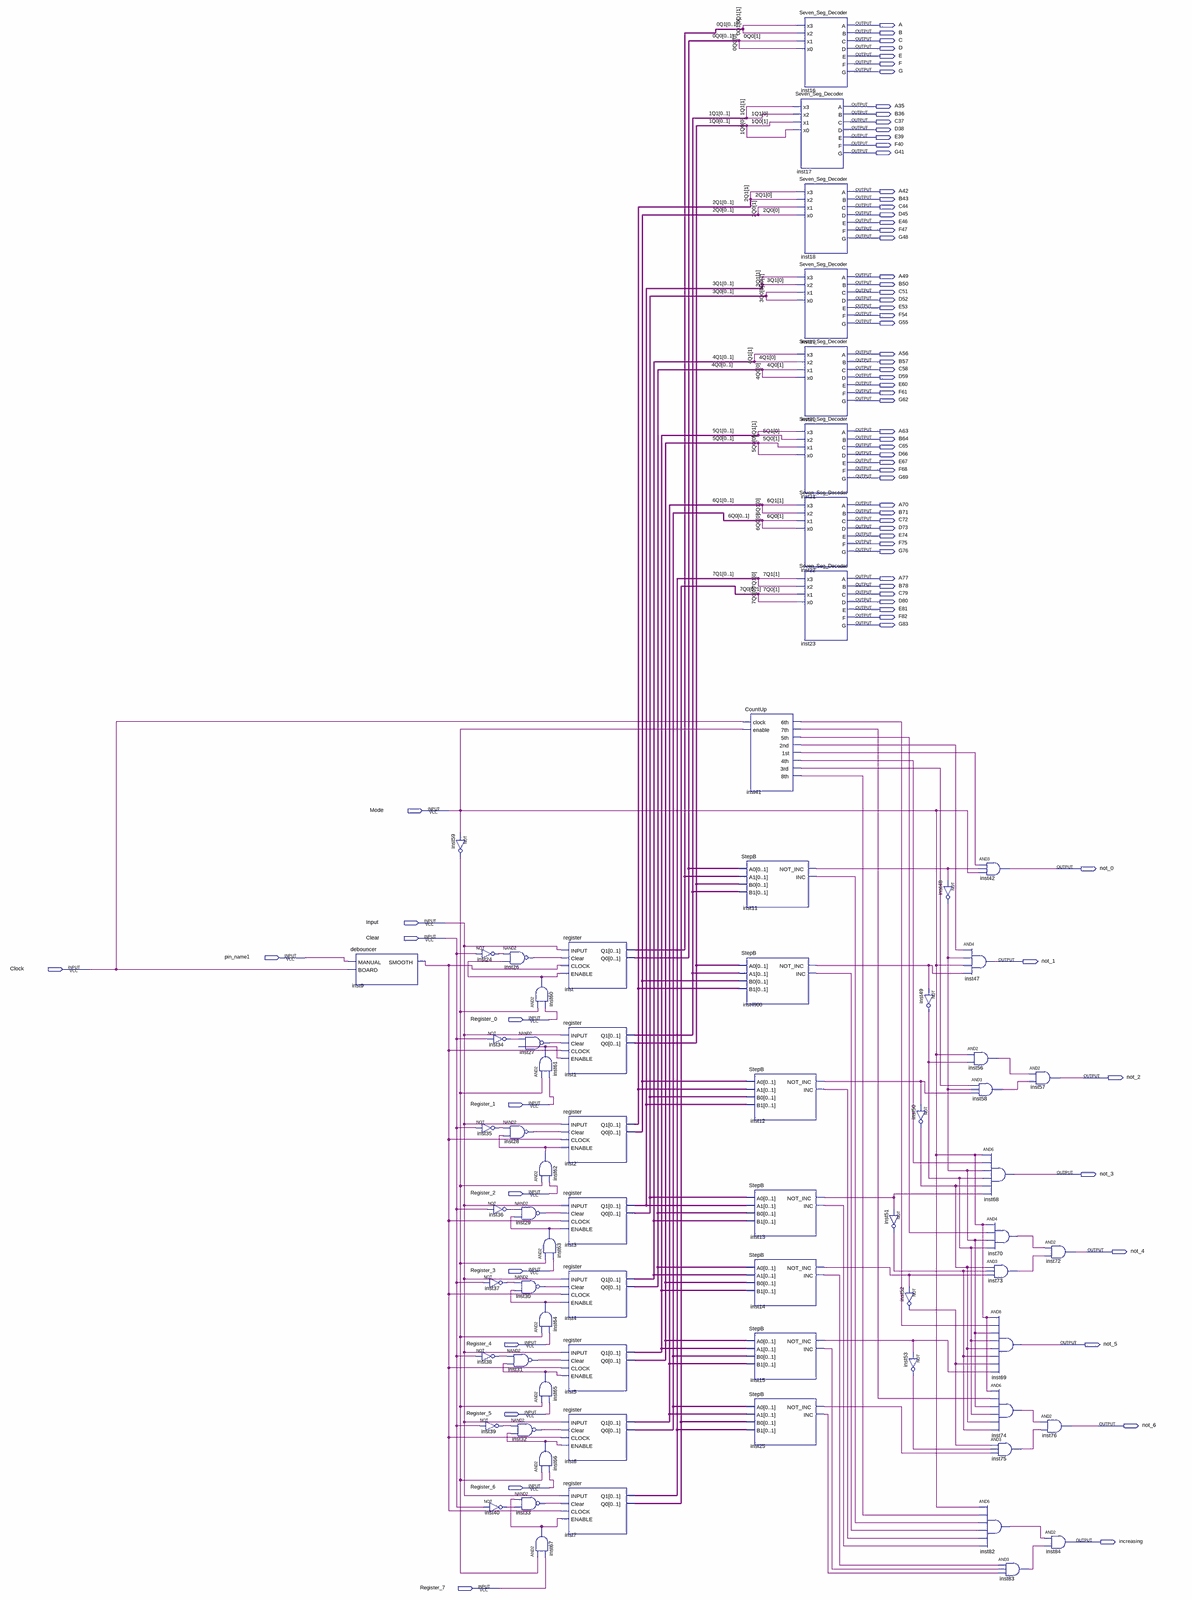
[diagram p0: schematic sheet, whole]
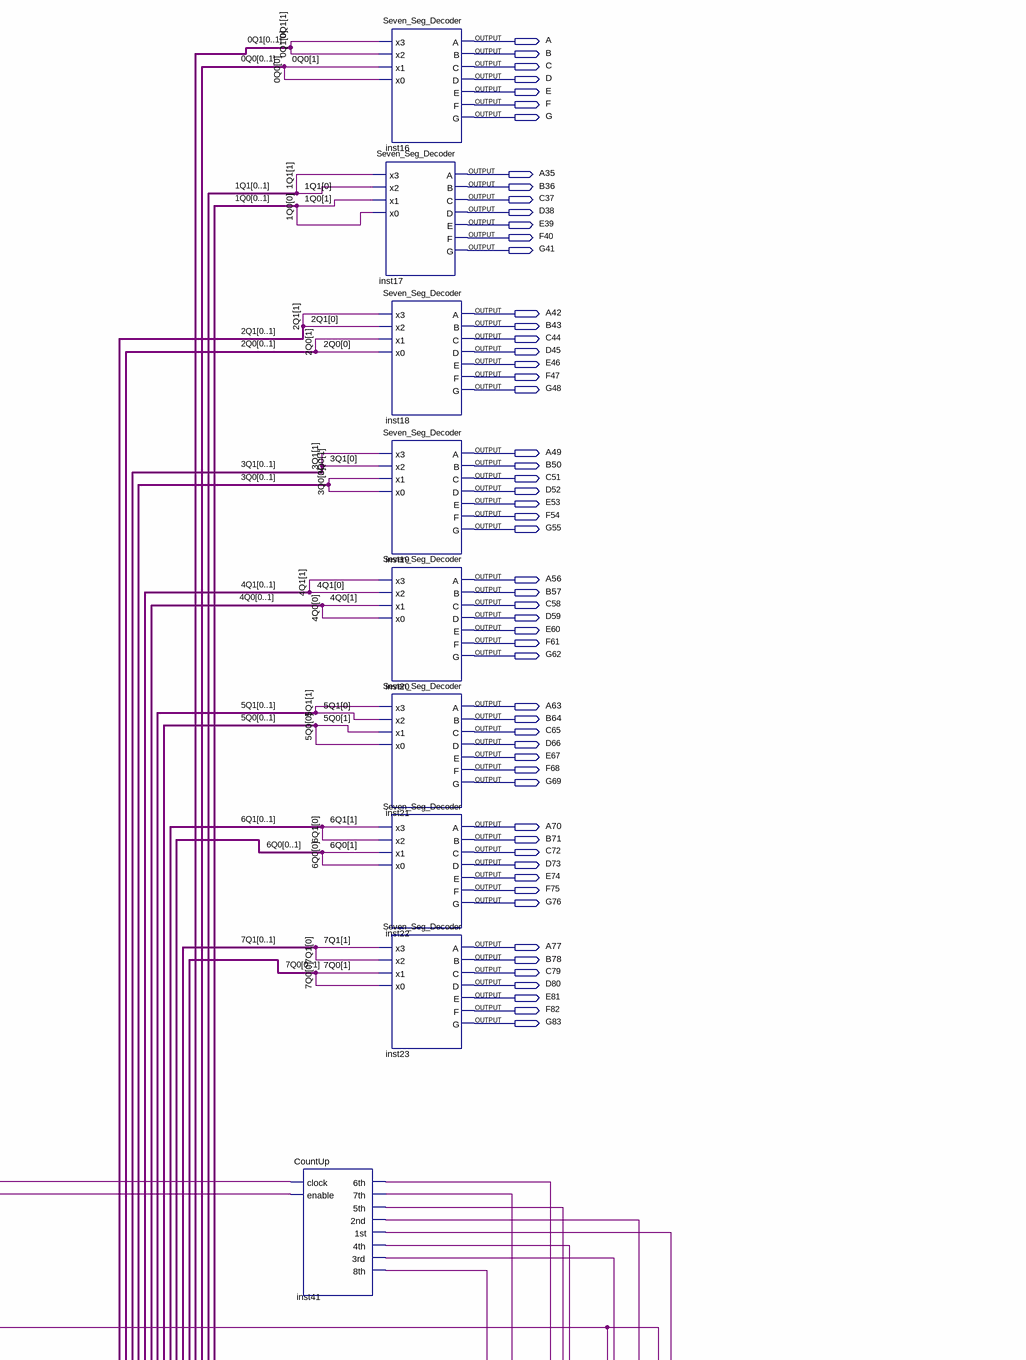
[diagram p1: schematic sheet, upper right part]
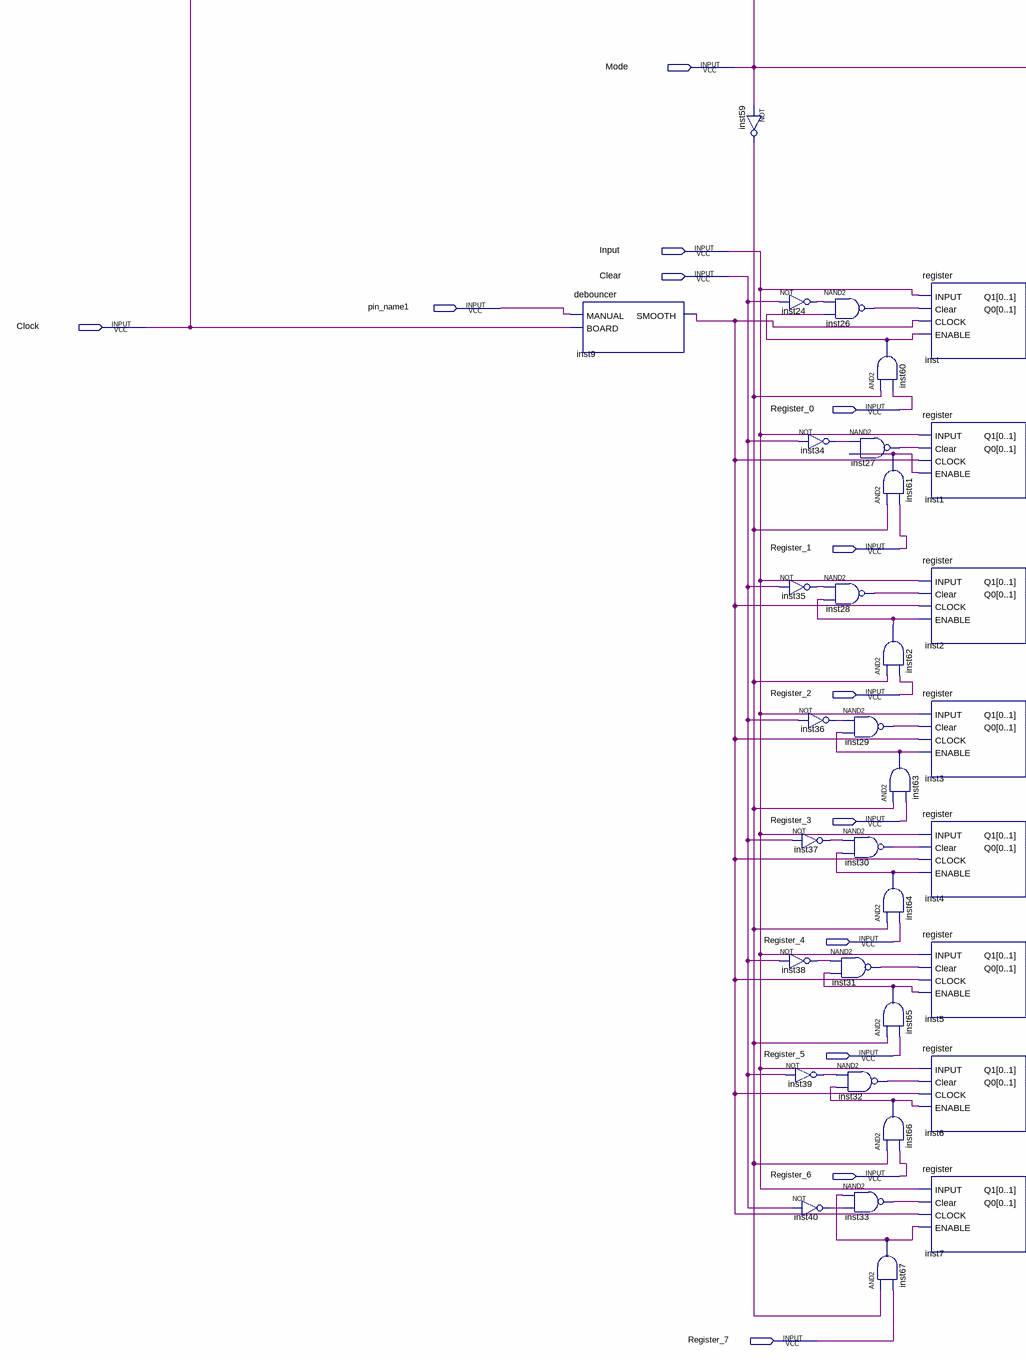
[diagram p2: schematic sheet, lower left part]
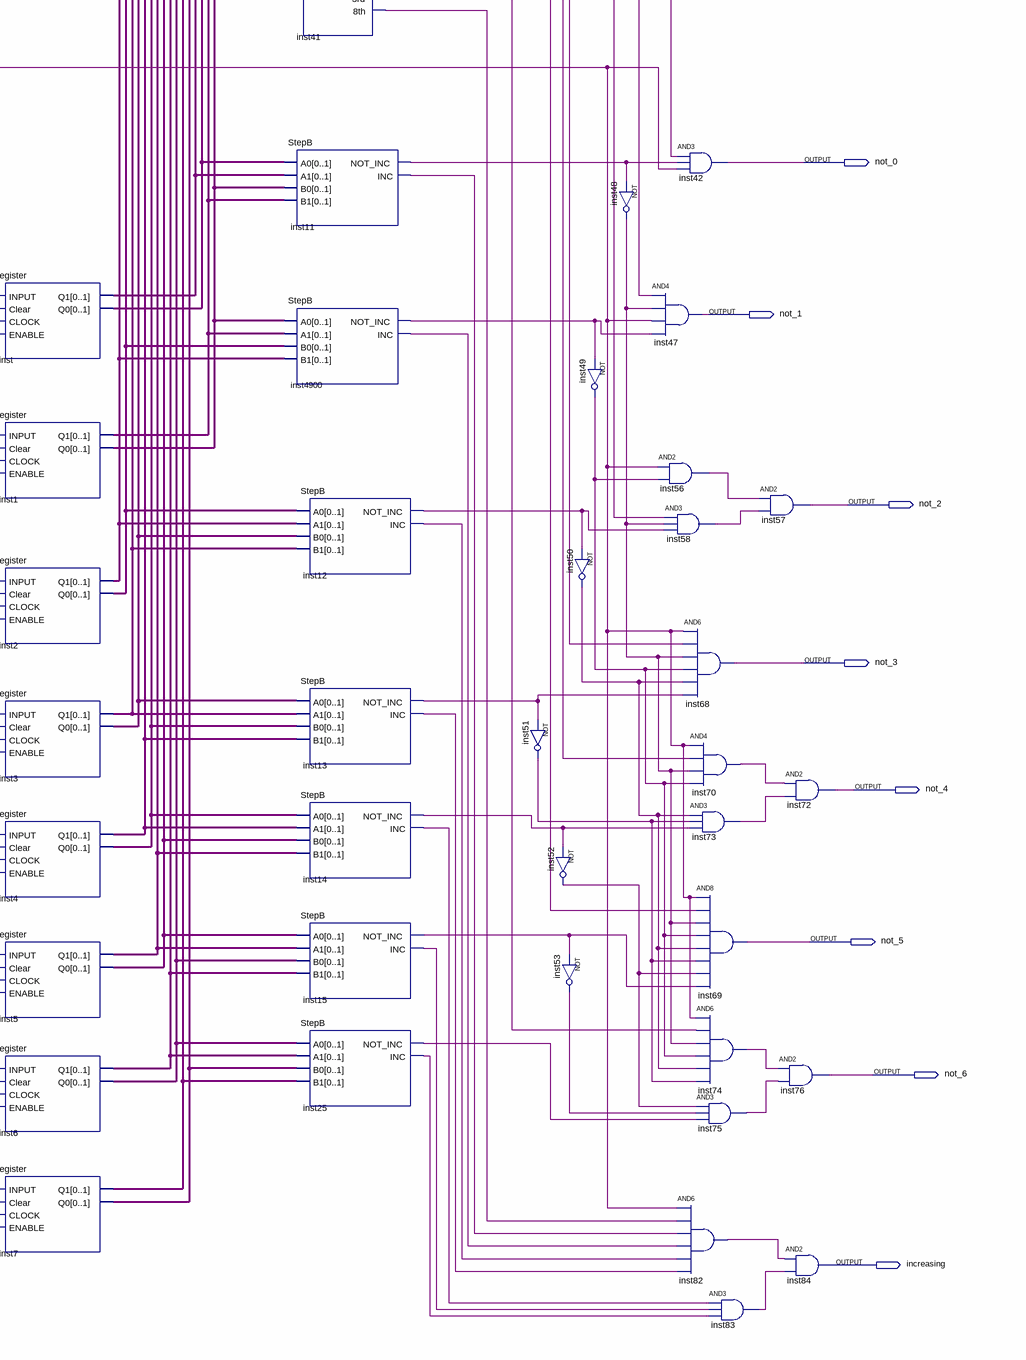
[diagram p3: schematic sheet, lower right part]
// Quartus schematic stepD.bdf as structural Verilog: 72 symbols, 77 pins
module stepD (
  input  Mode,
  input  Input,
  input  Clear,
  input  pin_name1,
  input  Clock,
  input  Register_0,
  input  Register_1,
  input  Register_2,
  input  Register_3,
  input  Register_4,
  input  Register_5,
  input  Register_6,
  input  Register_7,
  output A,
  output B,
  output C,
  output D,
  output E,
  output F,
  output G,
  output A35,
  output B36,
  output C37,
  output D38,
  output E39,
  output F40,
  output G41,
  output A42,
  output B43,
  output C44,
  output D45,
  output E46,
  output F47,
  output G48,
  output A49,
  output B50,
  output C51,
  output D52,
  output E53,
  output F54,
  output G55,
  output A56,
  output B57,
  output C58,
  output D59,
  output E60,
  output F61,
  output G62,
  output A63,
  output B64,
  output C65,
  output D66,
  output E67,
  output F68,
  output G69,
  output A70,
  output B71,
  output C72,
  output D73,
  output E74,
  output F75,
  output G76,
  output A77,
  output B78,
  output C79,
  output D80,
  output E81,
  output F82,
  output G83,
  output not_0,
  output not_1,
  output not_2,
  output not_3,
  output not_4,
  output not_5,
  output not_6,
  output increasing
);

  wire inst9_smooth, inst11_inc, inst11_not_inc, inst12_inc, inst12_not_inc, inst13_inc, inst13_not_inc,
       inst14_inc, inst14_not_inc, inst15_inc, inst15_not_inc, inst24_out, inst25_inc, inst25_not_inc,
       inst26_out, inst27_out, inst28_out, inst29_out, inst30_out, inst31_out, inst32_out, inst33_out,
       inst34_out, inst35_out, inst36_out, inst37_out, inst38_out, inst39_out, inst40_out, inst41_1st,
       inst41_2nd, inst41_3rd, inst41_4th, inst41_5th, inst41_6th, inst41_7th, inst41_8th, inst48_out,
       inst49_out, inst50_out, inst51_out, inst52_out, inst53_out, inst56_out, inst58_out, inst59_out,
       inst60_out, inst61_out, inst62_out, inst63_out, inst64_out, inst65_out, inst66_out, inst67_out,
       inst70_out, inst73_out, inst74_out, inst75_out, inst82_out, inst83_out, inst4900_inc, inst4900_not_inc;
  wire [1:0] \0Q0 , \0Q1 , \1Q0 , \1Q1 , \2Q0 , \2Q1 , \3Q0 , \3Q1 , \4Q0 , \4Q1 , \5Q0 , \5Q1 , \6Q0 ,
       \6Q1 , \7Q0 , \7Q1 ;

  debouncer inst9 (.MANUAL(pin_name1), .BOARD(Clock), .SMOOTH(inst9_smooth));
  not inst59 (inst59_out, Mode);
  not inst24 (inst24_out, Clear);
  not inst34 (inst34_out, Clear);
  not inst35 (inst35_out, Clear);
  not inst36 (inst36_out, Clear);
  not inst37 (inst37_out, Clear);
  not inst38 (inst38_out, Clear);
  not inst39 (inst39_out, Clear);
  not inst40 (inst40_out, Clear);
  nand inst26 (inst26_out, inst24_out, inst60_out);
  nand inst27 (inst27_out, inst34_out, inst61_out);
  nand inst28 (inst28_out, inst35_out, inst62_out);
  nand inst29 (inst29_out, inst36_out, inst63_out);
  nand inst30 (inst30_out, inst37_out, inst64_out);
  nand inst31 (inst31_out, inst38_out, inst65_out);
  nand inst32 (inst32_out, inst39_out, inst66_out);
  nand inst33 (inst33_out, inst67_out, inst40_out);
  and inst60 (inst60_out, inst59_out, Register_0);
  and inst61 (inst61_out, inst59_out, Register_1);
  and inst62 (inst62_out, inst59_out, Register_2);
  and inst63 (inst63_out, inst59_out, Register_3);
  and inst64 (inst64_out, inst59_out, Register_4);
  and inst65 (inst65_out, inst59_out, Register_5);
  and inst66 (inst66_out, inst59_out, Register_6);
  and inst67 (inst67_out, inst59_out, Register_7);
  register inst (
    .INPUT(Input), .Clear(inst26_out), .CLOCK(inst9_smooth), .ENABLE(inst60_out), .Q1({\0Q1 [0], \0Q1 [1]}),
    .Q0({\0Q0 [0], \0Q0 [1]}));
  register inst1 (
    .INPUT(Input), .Clear(inst27_out), .CLOCK(inst9_smooth), .ENABLE(inst61_out), .Q1({\1Q1 [0], \1Q1 [1]}),
    .Q0({\1Q0 [0], \1Q0 [1]}));
  register inst2 (
    .INPUT(Input), .Clear(inst28_out), .CLOCK(inst9_smooth), .ENABLE(inst62_out), .Q1({\2Q1 [0], \2Q1 [1]}),
    .Q0({\2Q0 [0], \2Q0 [1]}));
  register inst3 (
    .INPUT(Input), .Clear(inst29_out), .CLOCK(inst9_smooth), .ENABLE(inst63_out), .Q1({\3Q1 [0], \3Q1 [1]}),
    .Q0({\3Q0 [0], \3Q0 [1]}));
  register inst4 (
    .INPUT(Input), .Clear(inst30_out), .CLOCK(inst9_smooth), .ENABLE(inst64_out), .Q1({\4Q1 [0], \4Q1 [1]}),
    .Q0({\4Q0 [0], \4Q0 [1]}));
  register inst5 (
    .INPUT(Input), .Clear(inst31_out), .CLOCK(inst9_smooth), .ENABLE(inst65_out), .Q1({\5Q1 [0], \5Q1 [1]}),
    .Q0({\5Q0 [0], \5Q0 [1]}));
  register inst6 (
    .INPUT(Input), .Clear(inst32_out), .CLOCK(inst9_smooth), .ENABLE(inst66_out), .Q1({\6Q1 [0], \6Q1 [1]}),
    .Q0({\6Q0 [0], \6Q0 [1]}));
  register inst7 (
    .INPUT(Input), .Clear(inst33_out), .CLOCK(inst9_smooth), .ENABLE(inst67_out), .Q1({\7Q1 [0], \7Q1 [1]}),
    .Q0({\7Q0 [0], \7Q0 [1]}));
  CountUp inst41 (
    .clock(Clock), .enable(Mode), .\6th (inst41_6th), .\7th (inst41_7th), .\5th (inst41_5th),
    .\2nd (inst41_2nd), .\1st (inst41_1st), .\4th (inst41_4th), .\3rd (inst41_3rd), .\8th (inst41_8th));
  StepB inst11 (
    .A0({\0Q0 [0], \0Q0 [1]}), .A1({\0Q1 [0], \0Q1 [1]}), .B0({\1Q0 [0], \1Q0 [1]}),
    .B1({\1Q1 [0], \1Q1 [1]}), .NOT_INC(inst11_not_inc), .INC(inst11_inc));
  StepB inst4900 (
    .A0({\1Q0 [0], \1Q0 [1]}), .A1({\1Q1 [0], \1Q1 [1]}), .B0({\2Q0 [0], \2Q0 [1]}),
    .B1({\2Q1 [0], \2Q1 [1]}), .NOT_INC(inst4900_not_inc), .INC(inst4900_inc));
  StepB inst12 (
    .A0({\2Q0 [0], \2Q0 [1]}), .A1({\2Q1 [0], \2Q1 [1]}), .B0({\3Q0 [0], \3Q0 [1]}),
    .B1({\3Q1 [0], \3Q1 [1]}), .NOT_INC(inst12_not_inc), .INC(inst12_inc));
  StepB inst13 (
    .A0({\3Q0 [0], \3Q0 [1]}), .A1({\3Q1 [0], \3Q1 [1]}), .B0({\4Q0 [0], \4Q0 [1]}),
    .B1({\4Q1 [0], \4Q1 [1]}), .NOT_INC(inst13_not_inc), .INC(inst13_inc));
  StepB inst14 (
    .A0({\4Q0 [0], \4Q0 [1]}), .A1({\4Q1 [0], \4Q1 [1]}), .B0({\5Q0 [0], \5Q0 [1]}),
    .B1({\5Q1 [0], \5Q1 [1]}), .NOT_INC(inst14_not_inc), .INC(inst14_inc));
  StepB inst15 (
    .A0({\5Q0 [0], \5Q0 [1]}), .A1({\5Q1 [0], \5Q1 [1]}), .B0({\6Q0 [0], \6Q0 [1]}),
    .B1({\6Q1 [0], \6Q1 [1]}), .NOT_INC(inst15_not_inc), .INC(inst15_inc));
  StepB inst25 (
    .A0({\6Q0 [0], \6Q0 [1]}), .A1({\6Q1 [0], \6Q1 [1]}), .B0({\7Q0 [0], \7Q0 [1]}),
    .B1({\7Q1 [0], \7Q1 [1]}), .NOT_INC(inst25_not_inc), .INC(inst25_inc));
  Seven_Seg_Decoder inst16 (
    .x3(\0Q1 [1]), .x2(\0Q1 [0]), .x1(\0Q0 [1]), .x0(\0Q0 [0]), .A(A), .B(B), .C(C), .D(D), .E(E), .F(F),
    .G(G));
  Seven_Seg_Decoder inst17 (
    .x3(\1Q1 [1]), .x2(\1Q1 [0]), .x1(\1Q0 [1]), .x0(\1Q0 [0]), .A(A35), .B(B36), .C(C37), .D(D38), .E(E39),
    .F(F40), .G(G41));
  Seven_Seg_Decoder inst18 (
    .x3(\2Q1 [1]), .x2(\2Q1 [0]), .x1(\2Q0 [1]), .x0(\2Q0 [0]), .A(A42), .B(B43), .C(C44), .D(D45), .E(E46),
    .F(F47), .G(G48));
  Seven_Seg_Decoder inst19 (
    .x3(\3Q1 [1]), .x2(\3Q1 [0]), .x1(\3Q0 [1]), .x0(\3Q0 [0]), .A(A49), .B(B50), .C(C51), .D(D52), .E(E53),
    .F(F54), .G(G55));
  Seven_Seg_Decoder inst20 (
    .x3(\4Q1 [1]), .x2(\4Q1 [0]), .x1(\4Q0 [1]), .x0(\4Q0 [0]), .A(A56), .B(B57), .C(C58), .D(D59), .E(E60),
    .F(F61), .G(G62));
  Seven_Seg_Decoder inst21 (
    .x3(\5Q1 [1]), .x2(\5Q1 [0]), .x1(\5Q0 [1]), .x0(\5Q0 [0]), .A(A63), .B(B64), .C(C65), .D(D66), .E(E67),
    .F(F68), .G(G69));
  Seven_Seg_Decoder inst22 (
    .x3(\6Q1 [1]), .x2(\6Q1 [0]), .x1(\6Q0 [1]), .x0(\6Q0 [0]), .A(A70), .B(B71), .C(C72), .D(D73), .E(E74),
    .F(F75), .G(G76));
  Seven_Seg_Decoder inst23 (
    .x3(\7Q1 [1]), .x2(\7Q1 [0]), .x1(\7Q0 [1]), .x0(\7Q0 [0]), .A(A77), .B(B78), .C(C79), .D(D80), .E(E81),
    .F(F82), .G(G83));
  not inst51 (inst51_out, inst13_not_inc);
  not inst49 (inst49_out, inst4900_not_inc);
  not inst50 (inst50_out, inst12_not_inc);
  not inst52 (inst52_out, inst14_not_inc);
  not inst53 (inst53_out, inst15_not_inc);
  not inst48 (inst48_out, inst11_not_inc);
  and inst42 (not_0, inst41_1st, inst11_not_inc, Mode);
  and inst47 (not_1, inst41_2nd, inst48_out, Mode, inst4900_not_inc);
  and inst56 (inst56_out, Mode, inst49_out);
  and inst58 (inst58_out, inst41_3rd, inst48_out, inst12_not_inc);
  and inst68 (not_3, Mode, inst41_4th, inst48_out, inst49_out, inst50_out, inst13_not_inc);
  and inst82 (inst82_out, Mode, inst41_8th, inst11_inc, inst4900_inc, inst12_inc, inst13_inc);
  and inst70 (inst70_out, Mode, inst41_5th, inst48_out, inst49_out);
  and inst73 (inst73_out, inst50_out, inst51_out, inst14_not_inc);
  and inst69 (not_5, Mode, inst41_6th, inst48_out, inst49_out, inst50_out, inst51_out, inst52_out, inst15_not_inc);
  and inst74 (inst74_out, Mode, inst41_7th, inst48_out, inst49_out, inst50_out, inst51_out);
  and inst75 (inst75_out, inst52_out, inst53_out, inst25_not_inc);
  and inst83 (inst83_out, inst14_inc, inst15_inc, inst25_inc);
  and inst57 (not_2, inst56_out, inst58_out);
  and inst72 (not_4, inst70_out, inst73_out);
  and inst76 (not_6, inst74_out, inst75_out);
  and inst84 (increasing, inst82_out, inst83_out);
endmodule
